# Altium schematic sheet buffer.SchDoc
size A4
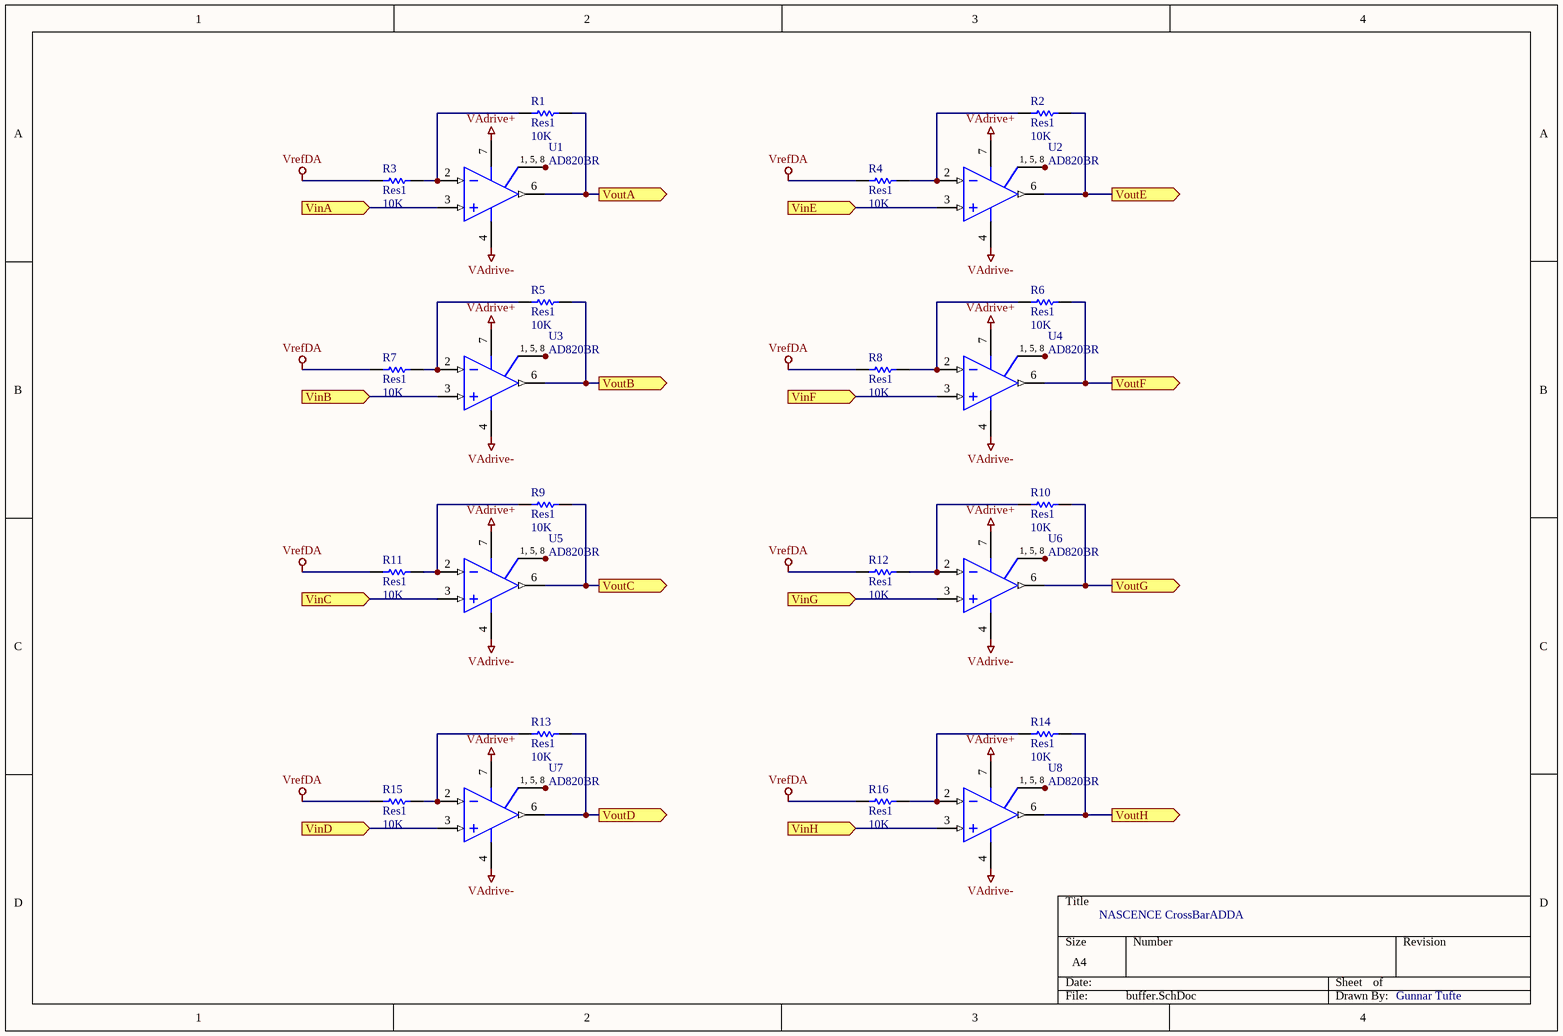
[diagram p0: buffer.SchDoc]

## Parts
R1  Res1  value 10K  [AXIAL-0.3]
R2  Res1  value 10K  [AXIAL-0.3]
R3  Res1  value 10K  [AXIAL-0.3]
R4  Res1  value 10K  [AXIAL-0.3]
R5  Res1  value 10K  [AXIAL-0.3]
R6  Res1  value 10K  [AXIAL-0.3]
R7  Res1  value 10K  [AXIAL-0.3]
R8  Res1  value 10K  [AXIAL-0.3]
R9  Res1  value 10K  [AXIAL-0.3]
R10  Res1  value 10K  [AXIAL-0.3]
R11  Res1  value 10K  [AXIAL-0.3]
R12  Res1  value 10K  [AXIAL-0.3]
R13  Res1  value 10K  [AXIAL-0.3]
R14  Res1  value 10K  [AXIAL-0.3]
R15  Res1  value 10K  [AXIAL-0.3]
R16  Res1  value 10K  [AXIAL-0.3]
U1  AD820BR  [R-8D_N]
U2  AD820BR  [R-8D_N]
U3  AD820BR  [R-8D_N]
U4  AD820BR  [R-8D_N]
U5  AD820BR  [R-8D_N]
U6  AD820BR  [R-8D_N]
U7  AD820BR  [R-8D_N]
U8  AD820BR  [R-8D_N]

## Ports
VinA (in), VinB (in), VinC (in), VinD (in), VinE (in), VinF (in), VinG (in), VinH (in), VoutA (out), VoutB (out), VoutC (out), VoutD (out), VoutE (out), VoutF (out), VoutG (out), VoutH (out)

## Nets
VAdrive+: U1.7(V+) U2.7(V+) U3.7(V+) U4.7(V+) U5.7(V+) U6.7(V+) U7.7(V+) U8.7(V+)
VAdrive-: U1.4(V-) U2.4(V-) U3.4(V-) U4.4(V-) U5.4(V-) U6.4(V-) U7.4(V-) U8.4(V-)
VrefDA: R3.1 R4.1 R7.1 R8.1 R11.1 R12.1 R15.1 R16.1
VinA: U1.3(IN+) ; port VinA
VinB: U3.3(IN+) ; port VinB
VinC: U5.3(IN+) ; port VinC
VinD: U7.3(IN+) ; port VinD
VinE: U2.3(IN+) ; port VinE
VinF: U4.3(IN+) ; port VinF
VinG: U6.3(IN+) ; port VinG
VinH: U8.3(IN+) ; port VinH
VoutA: R1.2 U1.6(OUT) ; port VoutA
VoutB: R5.2 U3.6(OUT) ; port VoutB
VoutC: R9.2 U5.6(OUT) ; port VoutC
VoutD: R13.2 U7.6(OUT) ; port VoutD
VoutE: R2.2 U2.6(OUT) ; port VoutE
VoutF: R6.2 U4.6(OUT) ; port VoutF
VoutG: R10.2 U6.6(OUT) ; port VoutG
VoutH: R14.2 U8.6(OUT) ; port VoutH
NetR1_1: R1.1 R3.2 U1.2(IN-)
NetR2_1: R2.1 R4.2 U2.2(IN-)
NetR5_1: R5.1 R7.2 U3.2(IN-)
NetR6_1: R6.1 R8.2 U4.2(IN-)
NetR9_1: R9.1 R11.2 U5.2(IN-)
NetR10_1: R10.1 R12.2 U6.2(IN-)
NetR13_1: R13.1 R15.2 U7.2(IN-)
NetR14_1: R14.1 R16.2 U8.2(IN-)
NetU1_1: U1.1(NC) U1.5(NC) U1.8(NC)
NetU2_1: U2.1(NC) U2.5(NC) U2.8(NC)
NetU3_1: U3.1(NC) U3.5(NC) U3.8(NC)
NetU4_1: U4.1(NC) U4.5(NC) U4.8(NC)
NetU5_1: U5.1(NC) U5.5(NC) U5.8(NC)
NetU6_1: U6.1(NC) U6.5(NC) U6.8(NC)
NetU7_1: U7.1(NC) U7.5(NC) U7.8(NC)
NetU8_1: U8.1(NC) U8.5(NC) U8.8(NC)

## Notes on the sheet
- NASCENCE CrossBarADDA
- Gunnar Tufte
- (in symbol AD820BR) 1, 5, 8

## Library data of the parts
R1-R16 = Res1: Resistor; Published: 8-Jun-2000; LatestRevisionDate: 17-Jul-2002; LatestRevisionNote: Re-released for DXP Platform.; PackageReference: AXIAL-0.3; Publisher: Altium Limited; PackageDescription: Axial Device, Thru-Hole; 2 Leads; 0.3 in Pin Spacing
U1-U8 = AD820BR: Single-Supply, Rail-to-Rail Low-Power FET-Input Operational Amplifier; Note: Pins 1, 5 and 8 are not connected.; Published: 8-Jun-2000; LatestRevisionDate: 13-Apr-2006; LatestRevisionNote: IPC-7351 Footprint Added.; DatasheetVersion: REV. A; PackageVersion: 1998; PackageReference: R-8D; Publisher: Altium Limited; PackageDescription: 8-Pin Narrow Body Small Outline Integrated Circuit 1.27 mm Pitch; ComponentLink1Description: Manufacturer Link; ComponentLink1URL: http://www.analog.com/en/prod/0,,759_786_AD820%2C00.html; ComponentLink2Description: Datasheet; ComponentLink2URL: http://www.analog.com/UploadedFiles/Data_Sheets/446075391AD820_d.pdf